# Altium schematic sheet pulse_generator_pen.SchDoc
size A4; SheetNumber: 3; SheetTotal: 3
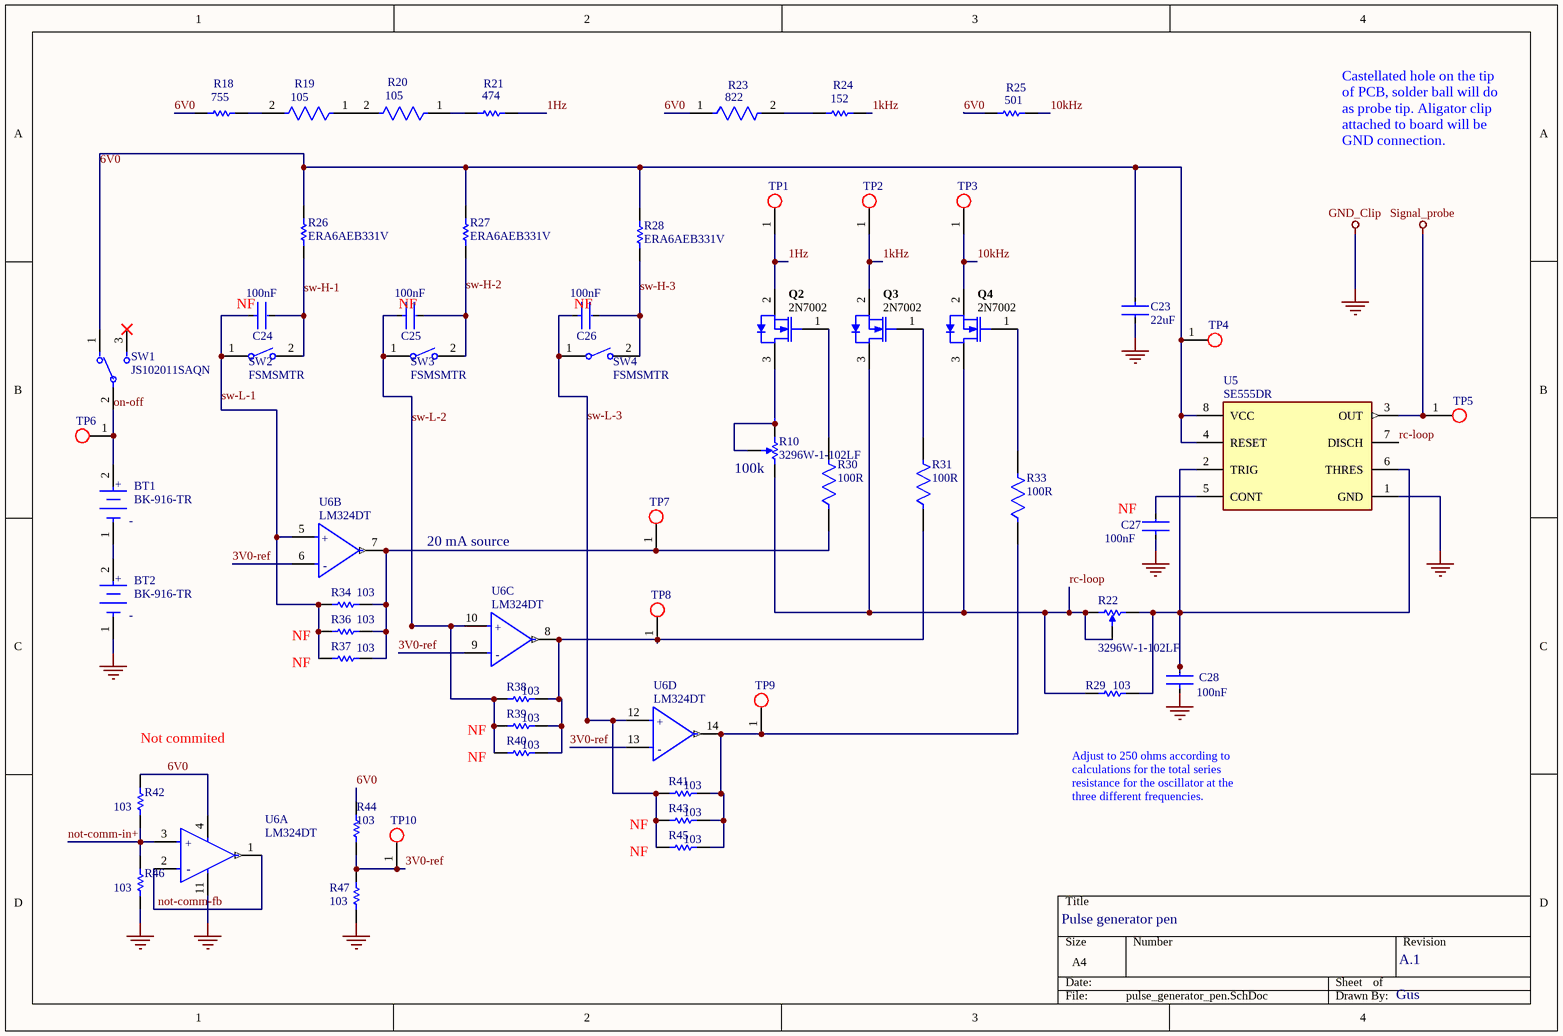
[diagram p0: pulse_generator_pen.SchDoc]

## Parts
BT1  BK-916-TR  [FP-BK-916-TR-MFG]
BT2  BK-916-TR  [FP-BK-916-TR-MFG]
C23  Capacitance: 22uF  [FP-C2012-125-0_2-IPC_A]  (hidden comment: C2012X5R1V226M125AC)
C24  Capacitance: 100nF  [FP-CL21-IPC_A]  (hidden comment: CL21B104KBCNNNC)
C25  Capacitance: 100nF  [FP-CL21-IPC_A]  (hidden comment: CL21B104KBCNNNC)
C26  Capacitance: 100nF  [FP-CL21-IPC_A]  (hidden comment: CL21B104KBCNNNC)
C27  Capacitance: 100nF  [FP-CL21-IPC_A]  (hidden comment: CL21B104KBCNNNC)
C28  Capacitance: 100nF  [FP-CL21-IPC_A]  (hidden comment: CL21B104KBCNNNC)
Q2  2N7002  [INF-PG-SOT23_M]
Q3  2N7002  [INF-PG-SOT23_M]
Q4  2N7002  [INF-PG-SOT23_M]
R10  3296W-1-102LF  [BOUR-3296W-1-3]
R18  Resistance: 755  [RESC2013X50X30LL20T20]  (hidden comment: CRCW08057M50JNEA)
R19  Resistance: 105  [FP-ERJ6EN-IPC_A]  (hidden comment: ERJ-6ENF1004V)
R20  Resistance: 105  [FP-ERJ6EN-IPC_A]  (hidden comment: ERJ-6ENF1004V)
R21  Resistance: 474  [RESC2013X70X40ML20T20]  (hidden comment: ERJ6ENF4703V)
R22  3296W-1-102LF  [BOUR-3296W-1-3]
R23  Resistance: 822  [FP-RC2012-IPC_A]  (hidden comment: RC2012J822CS)
R24  Resistance: 152  [RESC2013X60X35LL10T20]  (hidden comment: RC0805FR-071K5L)
R25  Resistance: 501  [RESC2013X58X38LL25T25]  (hidden comment: WSLP0805R0500FEA)
R26  ERA6AEB331V  [RESC2013X60X40LL20T25]
R27  ERA6AEB331V  [RESC2013X60X40LL20T25]
R28  ERA6AEB331V  [RESC2013X60X40LL20T25]
R29  Resistance: 103  [RESC2013X60X35NL10T20]  (hidden comment: RC0805FR-0710KL)
R30  Resistance: 100R  [FP-CRCW0805-HPe3-IPC_A]  (hidden comment: CRCW0805100RFKEAHP)
R31  Resistance: 100R  [FP-CRCW0805-HPe3-IPC_A]  (hidden comment: CRCW0805100RFKEAHP)
R33  Resistance: 100R  [FP-CRCW0805-HPe3-IPC_A]  (hidden comment: CRCW0805100RFKEAHP)
R34  Resistance: 103  [RESC2013X60X35NL10T20]  (hidden comment: RC0805FR-0710KL)
R36  Resistance: 103  [RESC2013X60X35NL10T20]  (hidden comment: RC0805FR-0710KL)
R37  Resistance: 103  [RESC2013X60X35NL10T20]  (hidden comment: RC0805FR-0710KL)
R38  Resistance: 103  [RESC2013X60X35NL10T20]  (hidden comment: RC0805FR-0710KL)
R39  Resistance: 103  [RESC2013X60X35NL10T20]  (hidden comment: RC0805FR-0710KL)
R40  Resistance: 103  [RESC2013X60X35NL10T20]  (hidden comment: RC0805FR-0710KL)
R41  Resistance: 103  [RESC2013X60X35NL10T20]  (hidden comment: RC0805FR-0710KL)
R42  Resistance: 103  [RESC2013X60X35NL10T20]  (hidden comment: RC0805FR-0710KL)
R43  Resistance: 103  [RESC2013X60X35NL10T20]  (hidden comment: RC0805FR-0710KL)
R44  Resistance: 103  [RESC2013X60X35NL10T20]  (hidden comment: RC0805FR-0710KL)
R45  Resistance: 103  [RESC2013X60X35NL10T20]  (hidden comment: RC0805FR-0710KL)
R46  Resistance: 103  [RESC2013X60X35NL10T20]  (hidden comment: RC0805FR-0710KL)
R47  Resistance: 103  [RESC2013X60X35NL10T20]  (hidden comment: RC0805FR-0710KL)
SW1  JS102011SAQN  [FP-JS102011SAQN-MFG]
SW2  FSMSMTR  [TECO-FSMSMTR_V]
SW3  FSMSMTR  [TECO-FSMSMTR_V]
SW4  FSMSMTR  [TECO-FSMSMTR_V]
TP1  TP_opening  [New footprint 1]  (value not drawn)
TP2  TP_opening  [New footprint 1]  (value not drawn)
TP3  TP_opening  [New footprint 1]  (value not drawn)
TP4  TP_opening  [New footprint 1]  (value not drawn)
TP5  TP_opening  [New footprint 1]  (value not drawn)
TP6  TP_opening  [New footprint 1]  (value not drawn)
TP7  TP_opening  [New footprint 1]  (value not drawn)
TP8  TP_opening  [New footprint 1]  (value not drawn)
TP9  TP_opening  [New footprint 1]  (value not drawn)
TP10  TP_opening  [New footprint 1]  (value not drawn)
U5  SE555DR  [FP-D0008A-MFG]
U6  LM324DT  [FP-SO-14-MFG]  (parts A,B,C,D of 4)

## Nets
GND: BT2.1(C) C23.2 C27.1 C28.1 R46.1 R47.1 U5.1(GND) U6.11(VCC-)  [also labelled GND_Clip]
Signal_probe: TP5.1 U5.3(OUT)
1Hz: Q2.2(SOURCE) R21.2 TP1.1
1kHz: Q3.2(SOURCE) R24.2 TP2.1
3V0-ref: R44.1 R47.2 TP10.1 U6.6(Inverting_Input_2) U6.9(Inverting_Input_3) U6.13(Inverting_Input_4)
6V0: C23.1 R18.2 R23.1 R25.1 R26.1 R27.1 R28.1 R42.2 R44.2 SW1.1 TP4.1 U5.4(RESET) U5.8(VCC) U6.4(VCC+)
10kHz: Q4.2(SOURCE) R25.2 TP3.1
not-comm-fb: U6.1(Output_1) U6.2(Inverting_Input_1)
not-comm-in+: R42.1 R46.2 U6.3(Non-Inverting_Input_1)
on-off: BT1.2(A) SW1.2(C) TP6.1
rc-loop: Q3.3(DRAIN) Q4.3(DRAIN) R10.2(B) R22.1(A) R22.3(TAP) R29.2 U5.7(DISCH)
sw-H-1: C24.2 R26.2 SW2.2
sw-H-2: C25.2 R27.2 SW3.2
sw-H-3: C26.2 R28.2 SW4.2
sw-L-1: C24.1 R34.2 R36.2 R37.2 SW2.1 U6.5(Non-Inverting_Input_2)
sw-L-2: C25.1 R38.2 R39.2 R40.2 SW3.1 U6.10(Non-Inverting_Input_3)
sw-L-3: C26.1 R41.2 R43.2 R45.2 SW4.1 U6.12(Non-Inverting_Input_4)
NetBT1_1: BT1.1(C) BT2.2(A)
NetC27_2: C27.2 U5.5(CONT)
NetC28_2: C28.2 R22.2(B) R29.1 U5.2(TRIG) U5.6(THRES)
NetQ2_1: Q2.1(GATE) R30.2
NetQ2_3: Q2.3(DRAIN) R10.1(A) R10.3(TAP)
NetQ3_1: Q3.1(GATE) R31.2
NetQ4_1: Q4.1(GATE) R33.2
NetR18_1: R18.1 R19.2
NetR19_1: R19.1 R20.2
NetR20_1: R20.1 R21.1
NetR23_2: R23.2 R24.1
NetR30_1: R30.1 R34.1 R36.1 R37.1 TP7.1 U6.7(Output_2)
NetR31_1: R31.1 R38.1 R39.1 R40.1 TP8.1 U6.8(Output_3)
NetR33_1: R33.1 R41.1 R43.1 R45.1 TP9.1 U6.14(Output_4)

Not connected (* = marked no-connect by the designer): SW1 3*

## Notes on the sheet
- Castellated hole on the tip of PCB, solder ball will do as probe tip. Aligator clip attached to board will be GND connection.
- (near C24) NF
- (near C25) NF
- (near C26) NF
- (near R10) 100k
- (near C27) NF
- 20 mA source
- NF
- (near R42) Not commited
- Adjust to 250 ohms according to calculations for the total series resistance for the oscillator at the three different frequencies.
- Pulse generator pen
- A.1
- Gus
- (in symbol CMP-12131-000005-1, part A) +; -
- (in symbol CMP-12131-000005-1, part B) +; -
- (in symbol CMP-12131-000005-1, part C) +; -
- (in symbol CMP-12131-000005-1, part D) +; -
- (in symbol CMP-136216-000004-1) +; -

## Library data of the parts
BT1 BT2 = CMP-136216-000004-1: BATTERY RETAINER COIN 12MM SMD; Number of Cells: 1; Termination: SMD/SMT; Mount: Surface Mount
C23 = CMP-2000-06038-3: Multilayer Ceramic Capacitors 22μF ±20% 35V X5R SMD 0805; Tolerance: 20%; RoHS Compliant: Yes; Height: 1.25mm; Termination: SMD/SMT; Case/Package: 0805; Thickness: 0.057inch; Max Operating Temperature: 85°C; Min Operating Temperature: -55°C; Voltage Rating (DC): 35V; Length: 0.079inch; Dielectric: X5R; Dielectric Material: Ceramic; Voltage Rating: 35V; Mount: Surface Mount; Package Quantity: 2000; Lead Free: Lead Free; Weight: 0.000194oz; REACH SVHC: No SVHC; Width: 0.049inch; Packaging: Tape and Reel; Series: C; Case Code (Metric): 2012; Case Code (Imperial): 0805
C24-C28 = CMP-2000-05017-2: CL21 Series 0805 100nF 50V ±10% Tolerance X7R Multilayer Ceramic Chip Capacitor; Depth: 1.25mm; Height: 0.85mm; Width: 0.049inch; Tolerance: 10%; Case Code (Metric): 2012; Case Code (Imperial): 0805; Material: Ceramic; Thickness: 0.037inch; Min Operating Temperature: -55°C; Contact Plating: Tin; Length: 2mm; Mount: Surface Mount; Voltage Rating (DC): 50V; Lead Free: Lead Free; Dielectric: X7R; Radiation Hardening: No; Voltage Rating: 50V; Case/Package: 0805; Packaging: Tape and Reel; Max Operating Temperature: 125°C; Voltage: 50V
Q2-Q4 = CMP-1149-00026-1: N-Channel OptiMOS Small-Signal-Transistor, 60 V VDS, 0.3 A ID, -55 to 150 degC, PG-SOT23, Reel, Green; Manufacturer: Infineon; RDS (on) (max) (@4.5V): 4,000 mOhm; VDS (max): 60 V; IDpuls (max): 1.2Â A; QG: 0.4Â nC; RDS (on) (max): 3,000 mOhm; RthJA (max): 250 K/W; ID (max): 0.3Â A; VGS(th) (max): 2.5Â V; VGS(th) (min): 1.5Â V; Green: TRUE; Ptot (max): 0.5Â W; PackageDescription: 3-Pin Small Outline Transistor Package, 2.9 x 1.3 mm Body, 0.95 mm Pitch; Halogen-free: TRUE; ComponentLink2Description: Datasheet; ComponentLink1URL: http://www.infineon.com/; Packing: Reel; DatasheetVersion: Rev. 2.4; PartNumber: 2N7002; PackageReference: PG-SOT23; PackageVersion: Apr-08; ComponentLink3URL: http://www.infineon.com/dgdl/SOT23-Package_Overview.pdf?folderId=db3a30431936bc4b0119532290053c66&fileId=db3a30431936bc4b0119533468123c85; ComponentLink1Description: Manufacturer URL; Mounting Technology: Surface Mount; ComponentLink3Description: Package Specification; ComponentLink2URL: http://www.infineon.com/dgdl/2N7002_Rev2.4.pdf?folderId=db3a3043156fd573011622e10b5c1f67&fileId=db3a304319bc939a0119c2a9461e79e6
R10 R22 = CMP-1747-00002-1: Square Trimpot(R) Trimming Potentiometer, 1000 Ohm, -55 to 125 degC, 3-Pin THD, RoHS, Tube; Case\Package: 0603; Tolerance: 1%; Power Rating: 100 mW; Voltage Rating: 75 V; Resistance: 4.7 kohm; ComponentLink2URL: http://www.bourns.com/docs/Product-Datasheets/3296.pdf; Packaging: Tape and Reel; REACH SVHC: Yes; ComponentLink1URL: http://www.bourns.com/; Case Code (Metric): 1608; Width: 0.8 mm; ComponentLink1Description: Manufacturer URL; DatasheetVersion: May-16; Max Operating Temperature: 155 degC; PackageReference: 3296W-1-3; PackageDescription: 3-Pin Through Hole Device, Body 9.53 x 4.83 mm, Pitch 2.54 mm; Weight: 7.1E-05 oz; ComponentLink2Description: Datasheet; RoHSCompliant: true; Min Operating Temperature: -55 degC; Radiation Hardening: No; Case Code (Imperial): 0603; Length: 1.6 mm; Package Quantity: 5000; Pins: 2; Mount: Surface Mount; Height: 0.45 mm
R18 = CMP-2001-04122-1: Manufacturer: Vishay Dale; Part Number: CRCW08057M50JNEA
R19 R20 = CMP-2001-04378-6: RES SMD 1M OHM 1% 1/8W 0805; Temperature Coefficient: 100ppm/°C; Power Rating: 125mW; Voltage Rating: 150V; Length: 2mm; Height: 0.6mm; Technology: THICK FILM; Max Operating Temperature: 155°C; Case Code (Metric): 2012; Number of Terminations: 2; Radiation Hardening: No; Package Quantity: 1; Case Code (Imperial): 0805; Tolerance: 1%; RoHS Compliant: Yes; Contact Plating: Tin; Case/Package: 0805; Max Power Dissipation: 125mW; REACH SVHC: No SVHC; Lead Free: Lead Free; Termination: SMD/SMT; Size Code: 0805; Resistance Tolerance: 1%; Construction: Rectangular; Series: ERJ; Resistor Type: Thick Film; Depth: 1.25mm; Packaging: Tape and Reel; Min Operating Temperature: -55°C; Mount: Surface Mount; Features: Automotive AEC-Q200; Voltage Rating (DC): 150V; Military Standard: Not; Width: 1.2mm; Number of Pins: 2
R21 = CMP-2001-00552-1: Manufacturer: Panasonic; Part Number: ERJ6ENF4703V
R23 = CMP-13261-006466-1: Res Thick Film 0805 8.2kΩ 5% 0.125W ±100ppm/°C Molded SMD T/R; Voltage Rating (DC): 150V; Max Power Dissipation: 125mW; Resistor Type: Thick Film; Height: 0.024inch; Number of Terminations: 2; Length: 0.079inch; Series: RC; Case/Package: 0805; Military Standard: Not; Temperature Coefficient: 100ppm/°C; Case Code (Imperial): 0805; Tolerance: 5%; Lead Free: Lead Free; Construction: Rectangular; Case Code (Metric): 2012; Depth: 1.25mm; Packaging: Tape and Reel; Radiation Hardening: No; RoHS Compliant: Yes; Width: 0.049inch; Min Operating Temperature: -55°C; Contact Plating: Tin; Max Operating Temperature: 155°C; Features: Moisture Resistant
R24 = CMP-1659-00010-2: RES 1.50K OHM 1/8W 1% 0805 SMD; Manufacturer: Yageo; PackageReference: 0805; ComponentLink1URL: http://www.yageo.com/documents/recent/PYu-RC_Group_51_RoHS_L_04.pdf; ComponentLink1Description: Datasheet; PartNumber: RC0805FR-071K5L
R25 = CMP-2001-04326-1: Manufacturer: Vishay Dale; Part Number: WSLP0805R0500FEA
R26-R28 = CMP-2001-00628-1: Manufacturer: Panasonic; Part Number: ERA6AEB331V
R29 R34 R36-R47 = CMP-1659-00013-4: Chip Resistor, 10 KOhm, +/- 1%, 0.125 W, -55 to 155 degC, 0805 (2012 Metric), RoHS, Tape and Reel; Manufacturer: Yageo; Voltage Rating: 150 V; Mount: Surface Mount; ComponentLink1Description: Manufacturer URL; ComponentLink2URL: http://www.yageo.com/documents/recent/PYu-RC_Group_51_RoHS_L_04.pdf; Pins: 2; Length: 2 mm; Min Operating Temperature: -55 degC; Height: 0.5 mm; Mounting Technology: Surface Mount; RoHSCompliant: true; REACH SVHC: No SVHC; ComponentLink1URL: http://www.yageo.com/; Max Operating Temperature: 155 degC; PackageReference: 0805; DatasheetVersion: Rev. 4, 02/2016; Package Quantity: 5000; Packaging: Tape and Reel; ComponentLink2Description: Datasheet; PackageDescription: 2-Pin Surface Mounted Device, Body 2 x 1.25 mm
R30 R31 R33 = CMP-02407-011702-1: RES Thick Film, 100Ω, 1%, 0.5W, 100ppm/°C, 0805; Power Rating: 330mW; Voltage Rating: 150V; Max Power Dissipation: 500mW; Case/Package: 0805; Radiation Hardening: No; Number of Terminations: 2; Features: Automotive AEC-Q200; RoHS Compliant: Yes; Height: 0.5mm; Technology: THICK FILM; Contact Plating: Tin; Series: CRCW-HP; Max Operating Temperature: 155°C; Tolerance: 1%; Package Quantity: 5000; Construction: Rectangular; Width: 1.2mm; Lead Free: Lead Free; Resistor Type: Thick Film; Resistance Tolerance: 1%; Length: 2mm; Weight: 0.000194oz; Termination: SMD/SMT; Depth: 1.25mm; Packaging: Tape and Reel; Voltage Rating (DC): 150V; Case Code (Imperial): 0805; Military Standard: Not; Case Code (Metric): 2012; Mount: Surface Mount; Min Operating Temperature: -55°C; Temperature Coefficient: 100ppm/°C
SW1 = CMP-2000-06501-2: SWITCH SLIDE SPDT 300MA 6V; Switch Function: On-On; Illumination Type: Non-Illuminated; Switch Travel: 2mm; Contact Resistance: 70mR; Actuator Material: Nylon; Electrical Life: 5000Cycles; Actuator Type: Standard; Max Operating Temperature: 85°C; Housing Material: Nylon; Radiation Hardening: No; Max Voltage Rating (DC): 6V; Package Quantity: 1; Case/Package: 100; Actuator Length: 2mm; Min Operating Temperature: -40°C; Contact Current Rating: 300mA; REACH SVHC: No SVHC; Throw Configuration: SPDT; Packaging: Tape and Reel; Contact Material: Copper Alloy; Max Current Rating: 300mA; Current Rating: 300mA; Mount: Surface Mount; Lead Free: Lead Free; Termination: Gull Wing; Voltage Rating (DC): 6V; Length: 9mm; Orientation: Right Angle; Contact Plating: Silver
SW2-SW4 = CMP-2000-07501-1: FSMSM Push Button Switch, 50 mA, -35 to 85 degC, 2-Pin SMD, RoHS, Tape and Reel; Manufacturer: TE Connectivity; Voltage Rating (DC): 24V; Electrical Life: 20000Cycles; Operating Force: 180gf; Switch Travel: 0.25mm; Contact Current Rating: 50mA; Case\/Package: SMD/SMT; Actuator Length: 1.07mm; Throw Configuration: SPST; Actuator Material: Polyamide; Contact Resistance: 100mOhm; Illumination Type: Illuminated; Max Voltage Rating (DC): 12V; Manufacturer URL: http://www.te.com/; Lead Free: LeadFree; Packaging: TapeandReel; Min Operating Temperature: -35degC; Mechanical Life: 20000Cycles; Mount: SurfaceMount; REACH SVHC: Unknown; Package Quantity: 1800; Package Reference: FSMSMTR; RoHSCompliant: true; Max Operating Temperature: 85degC; Orientation: Straight; ELV: Compliant; Datasheet URL: http://www.te.com/commerce/DocumentDelivery/DDEController?Action=showdoc&DocId=Customer+Drawing%7F1437566-3%7FC2%7Fpdf%7FEnglish%7FENG_CD_1437566-3_C2_1437566_3_1_c.dwg.pdf%7F1437566-4; Package Description: 2-Pin Surface Mount Device, Body 6 x 3.5 mm, Pitch 9.19 mm; Current Rating: 50mA; Contact Plating: Silver; Termination: GullWing; Datasheet Version: Rev. C2, 08/2014; Contact Material: Brass; Mounting Technology: SurfaceMount
TP1-TP10 = CMP-00030-00001-3: Soldermask opening or top layer pad for testing purposes
U5 = CMP-04858-000018-1: IC OSC SGL TIMER 100KHZ 8-SOIC; Nominal Supply Current: 4mA; Min Supply Voltage: 4.5V; Max Supply Voltage: 18V; High Level Output Current: -200mA; Quiescent Current: 12mA; Operating Supply Current: 10mA; Number of Timers/Counters: 1; Low Level Output Current: 200mA; Weight: 0.002677oz; Frequency: 100kHz; Lead Free: Lead Free; Supply Current: 4mA; RoHS Compliant: Yes; Package Quantity: 2500; Min Operating Temperature: -55°C; Series: -; Radiation Hardening: No; Contact Plating: Gold; Packaging: Tape and Reel; Case/Package: SOIC; Number of Pins: 8; Mount: Surface Mount; Max Operating Temperature: 125°C; REACH SVHC: No SVHC
U6 = CMP-12131-000005-1: IC OPAMP GP 4 CIRCUIT 14SO; Manufacturer: STMicroelectronics; Voltage Gain: 100dB; Standoff Height: 0.1mm; Bandwidth: 1.3MHz; Max Junction Temp: +150°C; Min Supply Voltage: 3V; Max Dual Supply Voltage: 15V; Min Dual Supply Voltage: 1.5V; Number Of Channels: 4; Nominal Supply Current: 0.7-1.5mA; Output Current Per Channel: 20-50mA; Max Supply Voltage: 30V; Input Offset Voltage: 2mV; Input Bias Current: 0.02uA; Device Class L1: Integrated Circuits (ICs); Device Class L3: Amplifiers - Op Amps; Temperature Range Low: 0°C; Package: SO-14; Temperature Range High: +70°C; Digikey Description: IC OPAMP GP 4 CIRCUIT 14SO; Device Class L2: Linear ICs; Footprint Url: https://www.st.com/content/ccc/resource/technical/document/datasheet/group3/10/8a/e6/12/f8/e8/49/ce/DM00366438/files/DM00366438.pdf/jcr:content/translations/en.DM00366438.pdf; Octopart: https://octopart.com/lm324dt-stmicroelectronics-39579146; ComponentLink2URL: https://www.st.com/content/ccc/resource/technical/document/datasheet/bd/fc/46/43/26/8f/40/7f/CD00001046.pdf/files/CD00001046.pdf/jcr:content/translations/en.CD00001046.pdf; ComponentLink2Description: Datasheet; Lead Free: Yes; Temperature: 0°C to +70°C; RoHS: TRUE; Gain Bandwidth: 1.3MHz; Manufacturer Part Number: LM324DT; Automotive: No; Category: IC; Height: 1.75mm; Mouser Description: LM324 Series 32 V 1.3 MHz Low Power Quad Operational Amplifier - SOIC-14